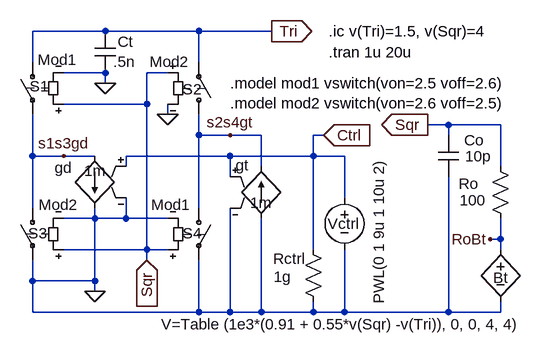
[diagram p0: schematic CurrSteerMin.asc]
CurrSteerMin.asc, the LTspice schematic file:
Version 4
SHEET 1 1100 680
WIRE -112 0 -112 -48
WIRE -112 144 -112 80
WIRE -112 224 -112 144
WIRE -112 336 -112 304
WIRE -112 384 -112 336
WIRE -64 144 -112 144
WIRE -16 144 -64 144
WIRE -16 240 -64 240
WIRE -16 240 -16 224
WIRE -16 336 -112 336
WIRE -16 336 -16 240
WIRE -16 352 -16 336
WIRE 0 -48 -112 -48
WIRE 0 16 -64 16
WIRE 0 32 0 16
WIRE 32 160 32 144
WIRE 32 240 -16 240
WIRE 32 240 32 208
WIRE 64 64 -64 64
WIRE 64 64 64 16
WIRE 64 288 -64 288
WIRE 64 288 64 64
WIRE 64 304 64 288
WIRE 96 16 64 16
WIRE 96 80 96 64
WIRE 96 240 32 240
WIRE 96 288 64 288
WIRE 144 -48 0 -48
WIRE 144 0 144 -48
WIRE 144 112 144 80
WIRE 144 224 144 112
WIRE 144 384 -112 384
WIRE 144 384 144 304
WIRE 192 112 144 112
WIRE 192 144 32 144
WIRE 192 176 192 144
WIRE 192 384 144 384
WIRE 192 384 192 224
WIRE 240 112 192 112
WIRE 240 160 240 112
WIRE 240 384 192 384
WIRE 240 384 240 240
WIRE 256 -48 144 -48
WIRE 320 144 192 144
WIRE 320 144 320 112
WIRE 320 288 320 144
WIRE 320 384 240 384
WIRE 320 384 320 368
WIRE 336 112 320 112
WIRE 368 144 320 144
WIRE 368 208 368 144
WIRE 368 384 320 384
WIRE 368 384 368 288
WIRE 528 96 496 96
WIRE 528 112 528 96
WIRE 528 384 368 384
WIRE 528 384 528 176
WIRE 608 96 528 96
WIRE 608 160 608 96
WIRE 608 272 592 272
WIRE 608 272 608 240
WIRE 608 288 608 272
WIRE 608 384 528 384
WIRE 608 384 608 368
FLAG 96 80 0
FLAG 496 96 Sqr
IOPIN 496 96 Out
FLAG 256 -48 Tri
IOPIN 256 -48 Out
FLAG -64 144 s1s3gd
FLAG -16 352 0
FLAG 192 112 s2s4gt
FLAG 64 304 Sqr
IOPIN 64 304 In
FLAG 592 272 RoBt
FLAG 0 32 0
FLAG 336 112 Ctrl
IOPIN 336 112 In
SYMBOL sw -112 -16 M0
WINDOW 0 -25 53 Left 0
WINDOW 3 -69 12 Left 0
SYMATTR InstName S1
SYMATTR Value Mod1
SYMBOL sw 144 96 M180
WINDOW 0 -25 55 Left 0
WINDOW 3 -76 97 Left 0
SYMATTR InstName S2
SYMATTR Value Mod2
SYMBOL sw -112 208 M0
WINDOW 0 -23 55 Left 0
WINDOW 3 -70 11 Left 0
SYMATTR InstName S3
SYMATTR Value Mod2
SYMBOL sw 144 208 R0
WINDOW 0 -25 55 Left 0
WINDOW 3 -73 11 Left 0
SYMATTR InstName S4
SYMATTR Value Mod1
SYMBOL bv 608 272 R0
WINDOW 0 -11 59 Left 0
WINDOW 3 -522 131 Left 0
SYMATTR InstName Bt
SYMATTR Value V=Table (1e3*(0.91 + 0.55*v(Sqr) -v(Tri)), 0, 0, 4, 4)
SYMBOL cap 16 -48 M0
WINDOW 0 -27 16 Left 0
WINDOW 3 -30 47 Left 0
SYMATTR InstName Ct
SYMATTR Value .5n
SYMBOL res 592 144 R0
WINDOW 0 -48 43 Left 0
WINDOW 3 -47 68 Left 0
SYMATTR InstName Ro
SYMATTR Value 100
SYMBOL cap 512 112 R0
WINDOW 0 40 8 Left 0
WINDOW 3 42 32 Left 0
SYMATTR InstName Co
SYMATTR Value 10p
SYMBOL voltage 368 192 R0
WINDOW 0 -26 56 Left 0
WINDOW 3 53 180 VLeft 0
WINDOW 123 0 0 Left 0
WINDOW 39 0 0 Left 0
SYMATTR InstName Vctrl
SYMATTR Value PWL(0 1 9u 1 10u 2)
SYMBOL res 304 272 R0
WINDOW 0 -46 30 Left 0
WINDOW 3 -45 58 Left 0
SYMATTR InstName Rctrl
SYMATTR Value 1g
SYMBOL g 240 144 R0
WINDOW 0 -39 14 Left 0
WINDOW 3 -17 72 Left 0
SYMATTR InstName gt
SYMATTR Value 1m
SYMBOL g2 -16 240 R180
WINDOW 0 35 78 Left 0
WINDOW 3 -17 73 Left 0
SYMATTR InstName gd
SYMATTR Value 1m
TEXT 192 32 Left 0 !.model mod1 vswitch(von=2.5 voff=2.6)\n.model mod2 vswitch(von=2.6 voff=2.5)
TEXT 344 -48 Left 0 !.ic v(Tri)=1.5, v(Sqr)=4
TEXT 344 -16 Left 0 !.tran 1u 20u

The netlist it stands for:
* CurrSteerMin.asc
S1 Tri s1s3gd Sqr 0 Mod1
S2 s2s4gt Tri Sqr 0 Mod2
S3 s1s3gd 0 Sqr 0 Mod2
S4 s2s4gt 0 Sqr 0 Mod1
Bt RoBt 0 V=Table (1e3*(0.91 + 0.55*v(Sqr) -v(Tri)), 0, 0, 4, 4)
Ct Tri 0 .5n
Ro Sqr RoBt 100
Co Sqr 0 10p
Vctrl Ctrl 0 PWL(0 1 9u 1 10u 2)
Rctrl Ctrl 0 1g
gt 0 s2s4gt Ctrl 0 1m
gd s1s3gd 0 Ctrl 0 1m
.model mod1 vswitch(von=2.5 voff=2.6)
.model mod2 vswitch(von=2.6 voff=2.5)
.ic v(Tri)=1.5, v(Sqr)=4
.tran 1u 20u
.backanno
.end